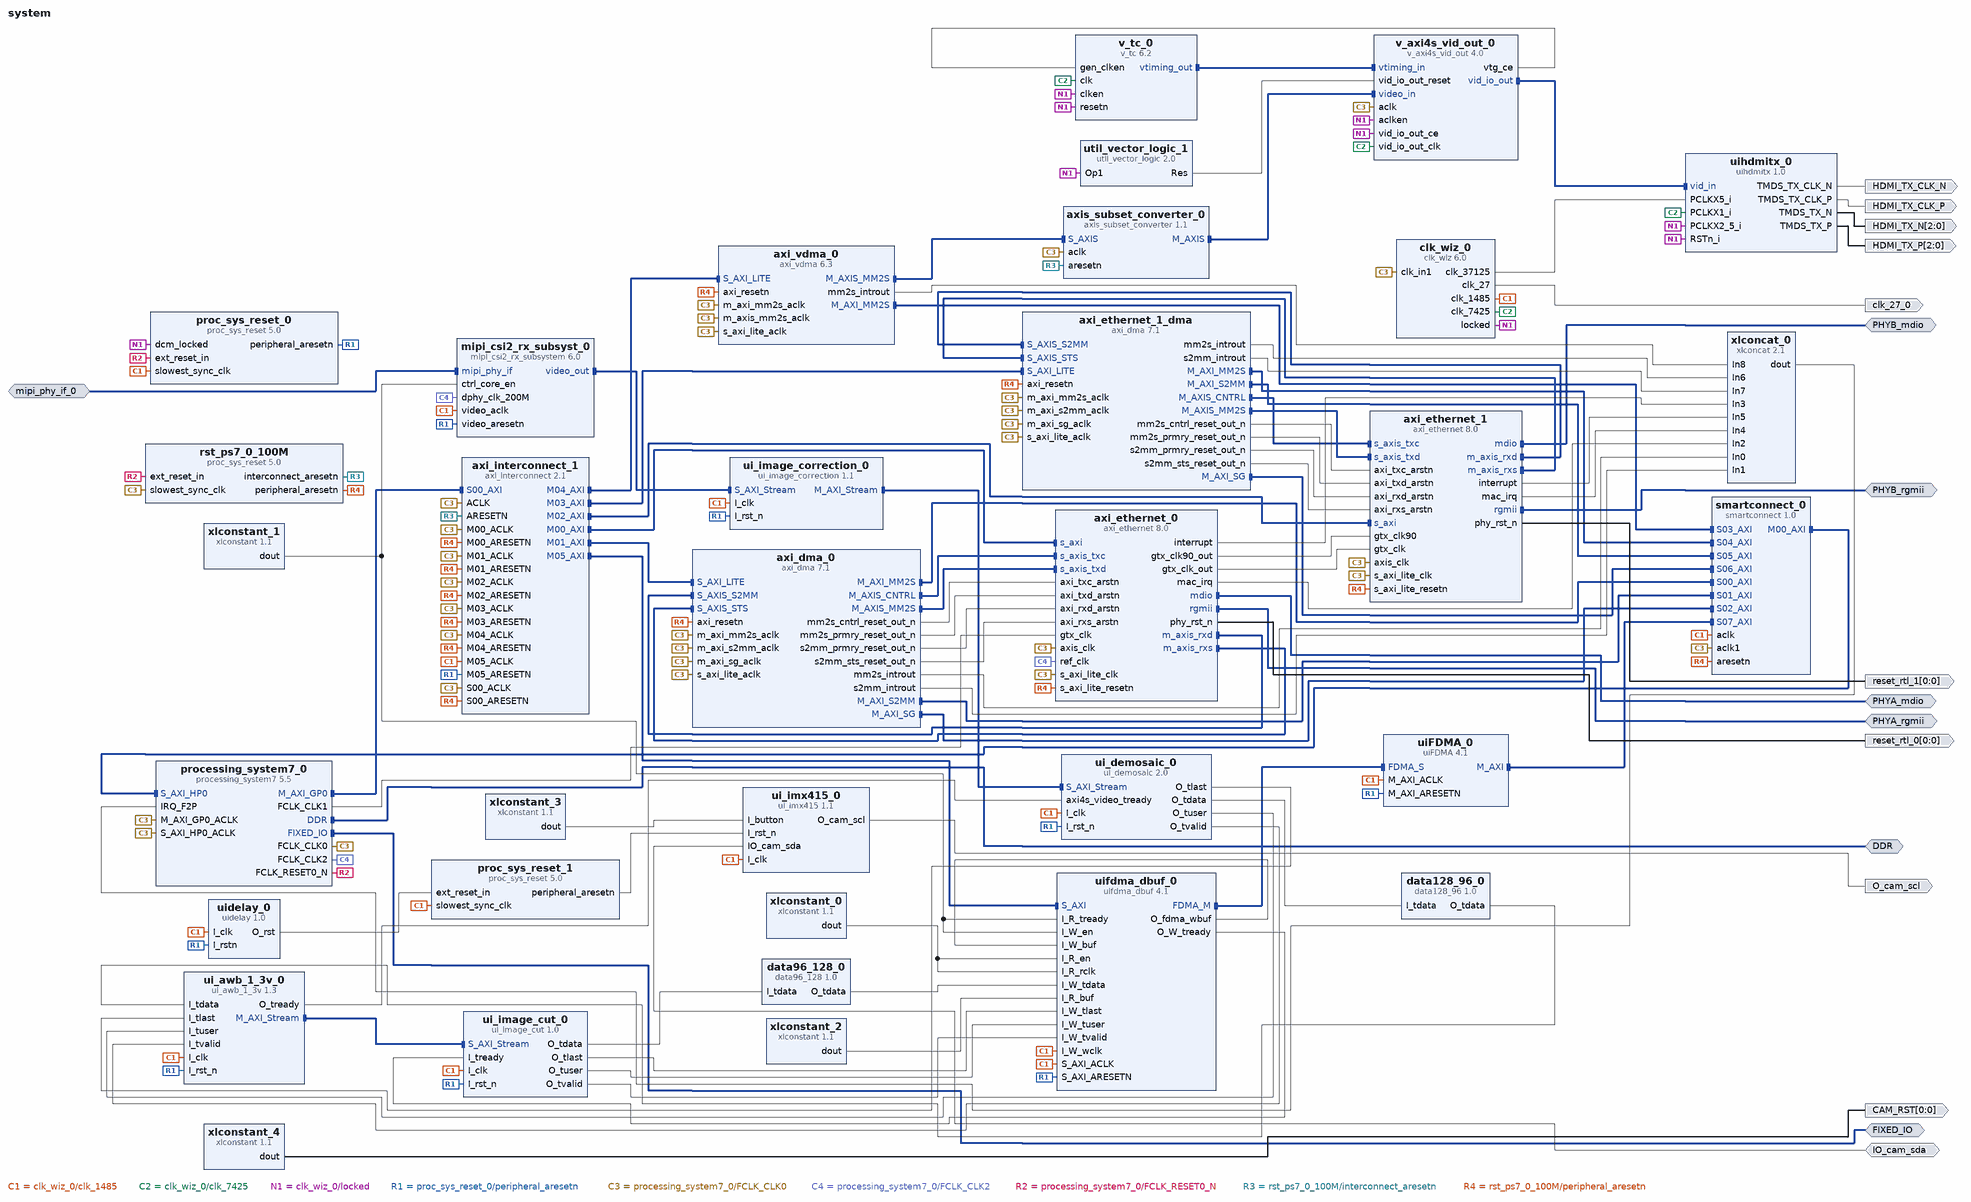
[diagram p0: block diagram of the top level]
# Vivado block design system, xc7z020clg484-2, Vivado 2025.2
create_bd_design system

create_bd_intf_port -mode Master -vlnv xilinx.com:interface:ddrx_rtl:1.0 DDR
create_bd_intf_port -mode Master -vlnv xilinx.com:display_processing_system7:fixedio_rtl:1.0 FIXED_IO
create_bd_intf_port -mode Master -vlnv xilinx.com:interface:mdio_rtl:1.0 PHYA_mdio
create_bd_intf_port -mode Master -vlnv xilinx.com:interface:rgmii_rtl:1.0 PHYA_rgmii
create_bd_intf_port -mode Master -vlnv xilinx.com:interface:mdio_rtl:1.0 PHYB_mdio
create_bd_intf_port -mode Master -vlnv xilinx.com:interface:rgmii_rtl:1.0 PHYB_rgmii
create_bd_intf_port -mode Slave -vlnv xilinx.com:interface:mipi_phy_rtl:1.0 mipi_phy_if_0
create_bd_port -dir O -type clk HDMI_TX_CLK_N
set_property -dict {CONFIG.ASSOCIATED_RESET phy_rst_n_0} [get_bd_ports HDMI_TX_CLK_N]
create_bd_port -dir O -type clk HDMI_TX_CLK_P
create_bd_port -dir O -from 2 -to 0 HDMI_TX_N
create_bd_port -dir O -from 2 -to 0 HDMI_TX_P
create_bd_port -dir O -from 0 -to 0 -type rst reset_rtl_1
set_property -dict {CONFIG.POLARITY ACTIVE_LOW} [get_bd_ports reset_rtl_1]
create_bd_port -dir O -from 0 -to 0 -type rst reset_rtl_0
set_property -dict {CONFIG.POLARITY ACTIVE_LOW} [get_bd_ports reset_rtl_0]
create_bd_port -dir O O_cam_scl
create_bd_port -dir IO IO_cam_sda
create_bd_port -dir O -type clk clk_27_0
create_bd_port -dir O -from 0 -to 0 CAM_RST

create_bd_cell -type ip -vlnv xilinx.com:ip:axi_dma:7.1 axi_dma_0
set_property -dict [list \
  CONFIG.c_include_mm2s_dre 1 \
  CONFIG.c_include_s2mm_dre 1 \
  CONFIG.c_m_axi_mm2s_data_width 64 \
  CONFIG.c_m_axi_s2mm_data_width 64 \
  CONFIG.c_mm2s_burst_size 8 \
  CONFIG.c_sg_length_width 16 \
  CONFIG.c_sg_use_stsapp_length 1 \
] [get_bd_cells axi_dma_0]
create_bd_cell -type ip -vlnv xilinx.com:ip:axi_ethernet:8.0 axi_ethernet_0
set_property -dict {CONFIG.IS_GT_WIZ_OLD 1 CONFIG.PHY_TYPE RGMII} [get_bd_cells axi_ethernet_0]
create_bd_cell -type ip -vlnv xilinx.com:ip:axi_ethernet:8.0 axi_ethernet_1
set_property -dict {CONFIG.IS_GT_WIZ_OLD 1 CONFIG.PHY_TYPE RGMII CONFIG.SupportLevel 0} [get_bd_cells axi_ethernet_1]
create_bd_cell -type ip -vlnv xilinx.com:ip:axi_dma:7.1 axi_ethernet_1_dma
set_property -dict [list \
  CONFIG.c_include_mm2s_dre 1 \
  CONFIG.c_include_s2mm_dre 1 \
  CONFIG.c_sg_length_width 16 \
  CONFIG.c_sg_use_stsapp_length 1 \
] [get_bd_cells axi_ethernet_1_dma]
create_bd_cell -type ip -vlnv xilinx.com:ip:axi_vdma:6.3 axi_vdma_0
set_property -dict [list \
  CONFIG.c_addr_width 64 \
  CONFIG.c_include_s2mm 0 \
  CONFIG.c_mm2s_genlock_mode 1 \
  CONFIG.c_mm2s_linebuffer_depth 2048 \
  CONFIG.c_mm2s_max_burst_length 64 \
  CONFIG.c_num_fstores 1 \
] [get_bd_cells axi_vdma_0]
create_bd_cell -type ip -vlnv xilinx.com:ip:axis_subset_converter:1.1 axis_subset_converter_0
set_property -dict [list \
  CONFIG.M_HAS_TKEEP 1 \
  CONFIG.M_HAS_TLAST 1 \
  CONFIG.M_HAS_TREADY 1 \
  CONFIG.M_HAS_TSTRB 0 \
  CONFIG.M_TDATA_NUM_BYTES 3 \
  CONFIG.M_TDEST_WIDTH 0 \
  CONFIG.M_TID_WIDTH 0 \
  CONFIG.M_TUSER_WIDTH 1 \
  CONFIG.S_HAS_TKEEP 1 \
  CONFIG.S_HAS_TLAST 1 \
  CONFIG.S_HAS_TREADY 1 \
  CONFIG.S_HAS_TSTRB 0 \
  CONFIG.S_TDATA_NUM_BYTES 4 \
  CONFIG.S_TDEST_WIDTH 0 \
  CONFIG.S_TID_WIDTH 0 \
  CONFIG.S_TUSER_WIDTH 1 \
  CONFIG.TDATA_REMAP {tdata[23:0]} \
  CONFIG.TKEEP_REMAP {tkeep[2:0]} \
  CONFIG.TLAST_REMAP {tlast[0]} \
  CONFIG.TUSER_REMAP {tuser[0:0]} \
] [get_bd_cells axis_subset_converter_0]
create_bd_cell -type ip -vlnv xilinx.com:ip:clk_wiz:6.0 clk_wiz_0
set_property -dict [list \
  CONFIG.CLKOUT1_JITTER 337.616 \
  CONFIG.CLKOUT1_PHASE_ERROR 322.999 \
  CONFIG.CLKOUT1_REQUESTED_OUT_FREQ 74.25 \
  CONFIG.CLKOUT2_JITTER 258.703 \
  CONFIG.CLKOUT2_PHASE_ERROR 322.999 \
  CONFIG.CLKOUT2_REQUESTED_OUT_FREQ 371.25 \
  CONFIG.CLKOUT2_USED true \
  CONFIG.CLKOUT3_JITTER 298.245 \
  CONFIG.CLKOUT3_PHASE_ERROR 322.999 \
  CONFIG.CLKOUT3_REQUESTED_OUT_FREQ 148.5 \
  CONFIG.CLKOUT3_USED true \
  CONFIG.CLKOUT4_JITTER 415.222 \
  CONFIG.CLKOUT4_PHASE_ERROR 322.999 \
  CONFIG.CLKOUT4_REQUESTED_OUT_FREQ 27.000 \
  CONFIG.CLKOUT4_USED true \
  CONFIG.CLK_OUT1_PORT clk_7425 \
  CONFIG.CLK_OUT2_PORT clk_37125 \
  CONFIG.CLK_OUT3_PORT clk_1485 \
  CONFIG.CLK_OUT4_PORT clk_27 \
  CONFIG.MMCM_CLKFBOUT_MULT_F 37.125 \
  CONFIG.MMCM_CLKOUT0_DIVIDE_F 10.000 \
  CONFIG.MMCM_CLKOUT1_DIVIDE 2 \
  CONFIG.MMCM_CLKOUT2_DIVIDE 5 \
  CONFIG.MMCM_CLKOUT3_DIVIDE 28 \
  CONFIG.MMCM_DIVCLK_DIVIDE 5 \
  CONFIG.NUM_OUT_CLKS 4 \
  CONFIG.USE_RESET false \
] [get_bd_cells clk_wiz_0]
create_bd_cell -type ip -vlnv xilinx.com:ip:processing_system7:5.5 processing_system7_0
set_property -dict [list \
  CONFIG.PCW_APU_PERIPHERAL_FREQMHZ 666.666666 \
  CONFIG.PCW_CPU_CPU_6X4X_MAX_RANGE 767 \
  CONFIG.PCW_ENET0_ENET0_IO {MIO 16 .. 27} \
  CONFIG.PCW_ENET0_GRP_MDIO_ENABLE 1 \
  CONFIG.PCW_ENET0_GRP_MDIO_IO {MIO 52 .. 53} \
  CONFIG.PCW_ENET0_PERIPHERAL_ENABLE 1 \
  CONFIG.PCW_ENET_RESET_ENABLE 0 \
  CONFIG.PCW_EN_CLK1_PORT 1 \
  CONFIG.PCW_EN_CLK2_PORT 1 \
  CONFIG.PCW_FCLK_CLK0_BUF FALSE \
  CONFIG.PCW_FPGA0_PERIPHERAL_FREQMHZ 100 \
  CONFIG.PCW_FPGA1_PERIPHERAL_FREQMHZ 125 \
  CONFIG.PCW_FPGA2_PERIPHERAL_FREQMHZ 200 \
  CONFIG.PCW_FPGA_FCLK1_ENABLE 1 \
  CONFIG.PCW_FPGA_FCLK2_ENABLE 1 \
  CONFIG.PCW_GPIO_MIO_GPIO_ENABLE 1 \
  CONFIG.PCW_GPIO_MIO_GPIO_IO MIO \
  CONFIG.PCW_I2C_RESET_ENABLE 0 \
  CONFIG.PCW_IRQ_F2P_INTR 1 \
  CONFIG.PCW_PERIPHERAL_BOARD_PRESET None \
  CONFIG.PCW_PRESET_BANK1_VOLTAGE {LVCMOS 1.8V} \
  CONFIG.PCW_QSPI_GRP_FBCLK_ENABLE 1 \
  CONFIG.PCW_QSPI_GRP_FBCLK_IO {MIO 8} \
  CONFIG.PCW_QSPI_GRP_SINGLE_SS_ENABLE 1 \
  CONFIG.PCW_QSPI_GRP_SINGLE_SS_IO {MIO 1 .. 6} \
  CONFIG.PCW_QSPI_PERIPHERAL_ENABLE 1 \
  CONFIG.PCW_QSPI_PERIPHERAL_FREQMHZ 125 \
  CONFIG.PCW_QSPI_QSPI_IO {MIO 1 .. 6} \
  CONFIG.PCW_SD0_GRP_CD_ENABLE 1 \
  CONFIG.PCW_SD0_GRP_CD_IO {MIO 47} \
  CONFIG.PCW_SD0_GRP_WP_ENABLE 0 \
  CONFIG.PCW_SD0_PERIPHERAL_ENABLE 1 \
  CONFIG.PCW_SD0_SD0_IO {MIO 40 .. 45} \
  CONFIG.PCW_SD1_GRP_CD_ENABLE 1 \
  CONFIG.PCW_SD1_GRP_CD_IO {MIO 9} \
  CONFIG.PCW_SD1_PERIPHERAL_ENABLE 1 \
  CONFIG.PCW_SD1_SD1_IO {MIO 10 .. 15} \
  CONFIG.PCW_SDIO_PERIPHERAL_FREQMHZ 50 \
  CONFIG.PCW_SINGLE_QSPI_DATA_MODE x4 \
  CONFIG.PCW_UART1_PERIPHERAL_ENABLE 1 \
  CONFIG.PCW_UART1_UART1_IO {MIO 48 .. 49} \
  CONFIG.PCW_UART_PERIPHERAL_FREQMHZ 100 \
  CONFIG.PCW_UIPARAM_DDR_FREQ_MHZ 533.333333 \
  CONFIG.PCW_UIPARAM_DDR_MEMORY_TYPE {DDR 3 (Low Voltage)} \
  CONFIG.PCW_UIPARAM_DDR_PARTNO {MT41K256M16 RE-125} \
  CONFIG.PCW_USB0_PERIPHERAL_ENABLE 1 \
  CONFIG.PCW_USB0_RESET_ENABLE 0 \
  CONFIG.PCW_USB0_USB0_IO {MIO 28 .. 39} \
  CONFIG.PCW_USB_RESET_ENABLE 1 \
  CONFIG.PCW_USB_RESET_SELECT {Share reset pin} \
  CONFIG.PCW_USE_FABRIC_INTERRUPT 1 \
  CONFIG.PCW_USE_S_AXI_HP0 1 \
] [get_bd_cells processing_system7_0]
# 509 more settings of processing_system7_0 are not shown: defaults, MIO pin electricals, DDR timing, and values the tool derives
create_bd_cell -type ip -vlnv xilinx.com:ip:proc_sys_reset:5.0 rst_ps7_0_100M
create_bd_cell -type ip -vlnv xilinx.com:user:uihdmitx:1.0 uihdmitx_0
set_property -dict {CONFIG.FAMILY 7FAMILY} [get_bd_cells uihdmitx_0]
create_bd_cell -type ip -vlnv xilinx.com:ip:util_vector_logic:2.0 util_vector_logic_1
set_property -dict {CONFIG.C_OPERATION not CONFIG.C_SIZE 1} [get_bd_cells util_vector_logic_1]
create_bd_cell -type ip -vlnv xilinx.com:ip:v_axi4s_vid_out:4.0 v_axi4s_vid_out_0
set_property -dict {CONFIG.C_HAS_ASYNC_CLK 1} [get_bd_cells v_axi4s_vid_out_0]
create_bd_cell -type ip -vlnv xilinx.com:ip:v_tc:6.2 v_tc_0
set_property -dict {CONFIG.HAS_AXI4_LITE false CONFIG.enable_detection false} [get_bd_cells v_tc_0]
create_bd_cell -type ip -vlnv xilinx.com:ip:xlconcat:2.1 xlconcat_0
set_property -dict {CONFIG.NUM_PORTS 9 CONFIG.dout_width 9} [get_bd_cells xlconcat_0]
create_bd_cell -type ip -vlnv xilinx.com:ip:mipi_csi2_rx_subsystem:6.0 mipi_csi2_rx_subsyst_0
set_property -dict [list \
  CONFIG.CMN_NUM_LANES 4 \
  CONFIG.CMN_NUM_PIXELS 4 \
  CONFIG.CMN_PXL_FORMAT RAW10 \
  CONFIG.CSI_CONTROLLER_REG_IF false \
  CONFIG.C_CSI_EN_CRC false \
  CONFIG.C_EN_7S_LINERATE_CHECK true \
  CONFIG.DPY_LINE_RATE 1000 \
] [get_bd_cells mipi_csi2_rx_subsyst_0]
create_bd_cell -type ip -vlnv xilinx.com:ip:proc_sys_reset:5.0 proc_sys_reset_0
create_bd_cell -type ip -vlnv xilinx.com:ip:xlconstant:1.1 xlconstant_1
create_bd_cell -type ip -vlnv xilinx.com:user:ui_image_correction:1.1 ui_image_correction_0
create_bd_cell -type ip -vlnv xilinx.com:user:ui_demosaic:2.0 ui_demosaic_0
create_bd_cell -type ip -vlnv xilinx.com:user:data128_96:1.0 data128_96_0
create_bd_cell -type ip -vlnv xilinx.com:user:data96_128:1.0 data96_128_0
create_bd_cell -type ip -vlnv xilinx.com:user:ui_awb_1_3v:1.3 ui_awb_1_3v_0
create_bd_cell -type ip -vlnv xilinx.com:user:ui_image_cut:1.0 ui_image_cut_0
set_property -dict [list \
  CONFIG.DATA_WIDTH 96 \
  CONFIG.IMG_HEIGHT 1080 \
  CONFIG.IMG_WIDTH 1920 \
  CONFIG.Pixel_Per_Clock 4 \
  CONFIG.SKIP_COLS_right 0 \
  CONFIG.SKIP_ROWS_bottom 0 \
] [get_bd_cells ui_image_cut_0]
create_bd_cell -type ip -vlnv xilinx.com:user:uifdma_dbuf:4.1 uifdma_dbuf_0
set_property -dict [list \
  CONFIG.R_BASEADDR 0x20000000 \
  CONFIG.R_BUFDEPTH 64 \
  CONFIG.R_DSIZEBITS 23 \
  CONFIG.W_BASEADDR 0x20000000 \
  CONFIG.W_DATAWIDTH 128 \
  CONFIG.W_DSIZEBITS 23 \
] [get_bd_cells uifdma_dbuf_0]
create_bd_cell -type ip -vlnv xilinx.com:ip:xlconstant:1.1 xlconstant_0
create_bd_cell -type ip -vlnv xilinx.com:user:uiFDMA:4.1 uiFDMA_0
create_bd_cell -type ip -vlnv xilinx.com:ip:axi_interconnect:2.1 axi_interconnect_1
set_property -dict {CONFIG.NUM_MI 6} [get_bd_cells axi_interconnect_1]
create_bd_cell -type ip -vlnv xilinx.com:ip:smartconnect:1.0 smartconnect_0
set_property -dict {CONFIG.NUM_CLKS 2 CONFIG.NUM_SI 8} [get_bd_cells smartconnect_0]
create_bd_cell -type ip -vlnv xilinx.com:user:ui_imx415:1.1 ui_imx415_0
set_property -dict {CONFIG.Resolution imx415_1920x1080} [get_bd_cells ui_imx415_0]
create_bd_cell -type ip -vlnv xilinx.com:user:uidelay:1.0 uidelay_0
create_bd_cell -type ip -vlnv xilinx.com:ip:xlconstant:1.1 xlconstant_2
set_property -dict {CONFIG.CONST_VAL 0 CONFIG.CONST_WIDTH 8} [get_bd_cells xlconstant_2]
create_bd_cell -type ip -vlnv xilinx.com:ip:proc_sys_reset:5.0 proc_sys_reset_1
create_bd_cell -type ip -vlnv xilinx.com:ip:xlconstant:1.1 xlconstant_3
set_property -dict {CONFIG.CONST_VAL 0 CONFIG.CONST_WIDTH 2} [get_bd_cells xlconstant_3]
create_bd_cell -type ip -vlnv xilinx.com:ip:xlconstant:1.1 xlconstant_4

# ---- connections ----

connect_bd_intf_net [get_bd_intf_pins axi_dma_0/M_AXIS_CNTRL] [get_bd_intf_pins axi_ethernet_0/s_axis_txc]
connect_bd_intf_net [get_bd_intf_pins axi_dma_0/M_AXIS_MM2S] [get_bd_intf_pins axi_ethernet_0/s_axis_txd]
connect_bd_intf_net [get_bd_intf_pins axi_dma_0/M_AXI_MM2S] [get_bd_intf_pins smartconnect_0/S00_AXI]
connect_bd_intf_net [get_bd_intf_pins axi_dma_0/M_AXI_S2MM] [get_bd_intf_pins smartconnect_0/S01_AXI]
connect_bd_intf_net [get_bd_intf_pins axi_dma_0/M_AXI_SG] [get_bd_intf_pins smartconnect_0/S02_AXI]
connect_bd_intf_net [get_bd_intf_pins axi_dma_0/S_AXIS_S2MM] [get_bd_intf_pins axi_ethernet_0/m_axis_rxd]
connect_bd_intf_net [get_bd_intf_pins axi_dma_0/S_AXIS_STS] [get_bd_intf_pins axi_ethernet_0/m_axis_rxs]
connect_bd_intf_net [get_bd_intf_ports PHYA_mdio] [get_bd_intf_pins axi_ethernet_0/mdio]
connect_bd_intf_net [get_bd_intf_ports PHYA_rgmii] [get_bd_intf_pins axi_ethernet_0/rgmii]
connect_bd_intf_net [get_bd_intf_pins axi_ethernet_1_dma/M_AXIS_CNTRL] [get_bd_intf_pins axi_ethernet_1/s_axis_txc]
connect_bd_intf_net [get_bd_intf_pins axi_ethernet_1_dma/M_AXIS_MM2S] [get_bd_intf_pins axi_ethernet_1/s_axis_txd]
connect_bd_intf_net [get_bd_intf_pins axi_ethernet_1_dma/M_AXI_MM2S] [get_bd_intf_pins smartconnect_0/S04_AXI]
connect_bd_intf_net [get_bd_intf_pins axi_ethernet_1_dma/M_AXI_S2MM] [get_bd_intf_pins smartconnect_0/S05_AXI]
connect_bd_intf_net [get_bd_intf_pins axi_ethernet_1_dma/M_AXI_SG] [get_bd_intf_pins smartconnect_0/S06_AXI]
connect_bd_intf_net [get_bd_intf_pins axi_ethernet_1_dma/S_AXIS_S2MM] [get_bd_intf_pins axi_ethernet_1/m_axis_rxd]
connect_bd_intf_net [get_bd_intf_pins axi_ethernet_1_dma/S_AXIS_STS] [get_bd_intf_pins axi_ethernet_1/m_axis_rxs]
connect_bd_intf_net [get_bd_intf_ports PHYB_mdio] [get_bd_intf_pins axi_ethernet_1/mdio]
connect_bd_intf_net [get_bd_intf_ports PHYB_rgmii] [get_bd_intf_pins axi_ethernet_1/rgmii]
connect_bd_intf_net [get_bd_intf_pins axi_ethernet_0/s_axi] [get_bd_intf_pins axi_interconnect_1/M00_AXI]
connect_bd_intf_net [get_bd_intf_pins axi_dma_0/S_AXI_LITE] [get_bd_intf_pins axi_interconnect_1/M01_AXI]
connect_bd_intf_net [get_bd_intf_pins axi_ethernet_1/s_axi] [get_bd_intf_pins axi_interconnect_1/M02_AXI]
connect_bd_intf_net [get_bd_intf_pins axi_ethernet_1_dma/S_AXI_LITE] [get_bd_intf_pins axi_interconnect_1/M03_AXI]
connect_bd_intf_net [get_bd_intf_pins axi_vdma_0/S_AXI_LITE] [get_bd_intf_pins axi_interconnect_1/M04_AXI]
connect_bd_intf_net [get_bd_intf_pins uifdma_dbuf_0/S_AXI] [get_bd_intf_pins axi_interconnect_1/M05_AXI]
connect_bd_intf_net [get_bd_intf_pins axi_vdma_0/M_AXIS_MM2S] [get_bd_intf_pins axis_subset_converter_0/S_AXIS]
connect_bd_intf_net [get_bd_intf_pins axi_vdma_0/M_AXI_MM2S] [get_bd_intf_pins smartconnect_0/S03_AXI]
connect_bd_intf_net [get_bd_intf_pins axis_subset_converter_0/M_AXIS] [get_bd_intf_pins v_axi4s_vid_out_0/video_in]
connect_bd_intf_net [get_bd_intf_pins ui_image_correction_0/S_AXI_Stream] [get_bd_intf_pins mipi_csi2_rx_subsyst_0/video_out]
connect_bd_intf_net -intf_net mipi_phy_if_0_1 [get_bd_intf_ports mipi_phy_if_0] [get_bd_intf_pins mipi_csi2_rx_subsyst_0/mipi_phy_if]
connect_bd_intf_net [get_bd_intf_ports DDR] [get_bd_intf_pins processing_system7_0/DDR]
connect_bd_intf_net [get_bd_intf_ports FIXED_IO] [get_bd_intf_pins processing_system7_0/FIXED_IO]
connect_bd_intf_net [get_bd_intf_pins processing_system7_0/M_AXI_GP0] [get_bd_intf_pins axi_interconnect_1/S00_AXI]
connect_bd_intf_net [get_bd_intf_pins smartconnect_0/M00_AXI] [get_bd_intf_pins processing_system7_0/S_AXI_HP0]
connect_bd_intf_net [get_bd_intf_pins uiFDMA_0/M_AXI] [get_bd_intf_pins smartconnect_0/S07_AXI]
connect_bd_intf_net [get_bd_intf_pins ui_awb_1_3v_0/M_AXI_Stream] [get_bd_intf_pins ui_image_cut_0/S_AXI_Stream]
connect_bd_intf_net [get_bd_intf_pins ui_image_correction_0/M_AXI_Stream] [get_bd_intf_pins ui_demosaic_0/S_AXI_Stream]
connect_bd_intf_net [get_bd_intf_pins uifdma_dbuf_0/FDMA_M] [get_bd_intf_pins uiFDMA_0/FDMA_S]
connect_bd_intf_net [get_bd_intf_pins uihdmitx_0/vid_in] [get_bd_intf_pins v_axi4s_vid_out_0/vid_io_out]
connect_bd_intf_net [get_bd_intf_pins v_axi4s_vid_out_0/vtiming_in] [get_bd_intf_pins v_tc_0/vtiming_out]
connect_bd_net [get_bd_ports IO_cam_sda] [get_bd_pins ui_imx415_0/IO_cam_sda]
connect_bd_net [get_bd_pins axi_dma_0/mm2s_cntrl_reset_out_n] [get_bd_pins axi_ethernet_0/axi_txc_arstn]
connect_bd_net [get_bd_pins axi_dma_0/mm2s_introut] [get_bd_pins xlconcat_0/In0]
connect_bd_net [get_bd_pins axi_dma_0/mm2s_prmry_reset_out_n] [get_bd_pins axi_ethernet_0/axi_txd_arstn]
connect_bd_net [get_bd_pins axi_dma_0/s2mm_introut] [get_bd_pins xlconcat_0/In1]
connect_bd_net [get_bd_pins axi_dma_0/s2mm_prmry_reset_out_n] [get_bd_pins axi_ethernet_0/axi_rxd_arstn]
connect_bd_net [get_bd_pins axi_dma_0/s2mm_sts_reset_out_n] [get_bd_pins axi_ethernet_0/axi_rxs_arstn]
connect_bd_net [get_bd_pins axi_ethernet_0/gtx_clk90_out] [get_bd_pins axi_ethernet_1/gtx_clk90]
connect_bd_net [get_bd_pins axi_ethernet_0/gtx_clk_out] [get_bd_pins axi_ethernet_1/gtx_clk]
connect_bd_net [get_bd_pins axi_ethernet_0/interrupt] [get_bd_pins xlconcat_0/In3]
connect_bd_net [get_bd_pins axi_ethernet_0/mac_irq] [get_bd_pins xlconcat_0/In2]
connect_bd_net [get_bd_pins axi_ethernet_0/phy_rst_n] [get_bd_ports reset_rtl_0]
connect_bd_net [get_bd_pins axi_ethernet_1_dma/mm2s_cntrl_reset_out_n] [get_bd_pins axi_ethernet_1/axi_txc_arstn]
connect_bd_net [get_bd_pins axi_ethernet_1_dma/mm2s_introut] [get_bd_pins xlconcat_0/In6]
connect_bd_net [get_bd_pins axi_ethernet_1_dma/mm2s_prmry_reset_out_n] [get_bd_pins axi_ethernet_1/axi_txd_arstn]
connect_bd_net [get_bd_pins axi_ethernet_1_dma/s2mm_introut] [get_bd_pins xlconcat_0/In7]
connect_bd_net [get_bd_pins axi_ethernet_1_dma/s2mm_prmry_reset_out_n] [get_bd_pins axi_ethernet_1/axi_rxd_arstn]
connect_bd_net [get_bd_pins axi_ethernet_1_dma/s2mm_sts_reset_out_n] [get_bd_pins axi_ethernet_1/axi_rxs_arstn]
connect_bd_net [get_bd_pins axi_ethernet_1/interrupt] [get_bd_pins xlconcat_0/In5]
connect_bd_net [get_bd_pins axi_ethernet_1/mac_irq] [get_bd_pins xlconcat_0/In4]
connect_bd_net [get_bd_pins axi_ethernet_1/phy_rst_n] [get_bd_ports reset_rtl_1]
connect_bd_net [get_bd_pins axi_vdma_0/mm2s_introut] [get_bd_pins xlconcat_0/In8]
connect_bd_net [get_bd_pins clk_wiz_0/clk_27] [get_bd_ports clk_27_0]
connect_bd_net [get_bd_pins clk_wiz_0/clk_1485] \
  [get_bd_pins mipi_csi2_rx_subsyst_0/video_aclk] [get_bd_pins ui_image_correction_0/I_clk] [get_bd_pins ui_demosaic_0/I_clk] \
  [get_bd_pins ui_awb_1_3v_0/I_clk] [get_bd_pins ui_image_cut_0/I_clk] [get_bd_pins uifdma_dbuf_0/S_AXI_ACLK] \
  [get_bd_pins uifdma_dbuf_0/I_W_wclk] [get_bd_pins uiFDMA_0/M_AXI_ACLK] [get_bd_pins proc_sys_reset_0/slowest_sync_clk] \
  [get_bd_pins axi_interconnect_1/M05_ACLK] [get_bd_pins smartconnect_0/aclk] [get_bd_pins ui_imx415_0/I_clk] \
  [get_bd_pins uidelay_0/I_clk] [get_bd_pins proc_sys_reset_1/slowest_sync_clk]
connect_bd_net [get_bd_pins clk_wiz_0/clk_37125] [get_bd_pins uihdmitx_0/PCLKX5_i]
connect_bd_net -net clk_wiz_0_clk_out1 [get_bd_pins clk_wiz_0/clk_7425] \
  [get_bd_pins uihdmitx_0/PCLKX1_i] [get_bd_pins v_axi4s_vid_out_0/vid_io_out_clk] [get_bd_pins v_tc_0/clk]
connect_bd_net [get_bd_pins clk_wiz_0/locked] \
  [get_bd_pins uihdmitx_0/RSTn_i] [get_bd_pins uihdmitx_0/PCLKX2_5_i] [get_bd_pins util_vector_logic_1/Op1] \
  [get_bd_pins v_axi4s_vid_out_0/aclken] [get_bd_pins v_axi4s_vid_out_0/vid_io_out_ce] [get_bd_pins v_tc_0/clken] \
  [get_bd_pins v_tc_0/resetn] [get_bd_pins proc_sys_reset_0/dcm_locked]
connect_bd_net [get_bd_pins data128_96_0/O_tdata] [get_bd_pins ui_awb_1_3v_0/I_tdata]
connect_bd_net [get_bd_pins data96_128_0/O_tdata] [get_bd_pins uifdma_dbuf_0/I_W_tdata]
connect_bd_net [get_bd_pins proc_sys_reset_0/peripheral_aresetn] \
  [get_bd_pins mipi_csi2_rx_subsyst_0/video_aresetn] [get_bd_pins ui_image_correction_0/I_rst_n] \
  [get_bd_pins ui_demosaic_0/I_rst_n] [get_bd_pins ui_awb_1_3v_0/I_rst_n] [get_bd_pins ui_image_cut_0/I_rst_n] \
  [get_bd_pins uifdma_dbuf_0/S_AXI_ARESETN] [get_bd_pins uiFDMA_0/M_AXI_ARESETN] [get_bd_pins axi_interconnect_1/M05_ARESETN] \
  [get_bd_pins uidelay_0/I_rstn]
connect_bd_net [get_bd_pins proc_sys_reset_1/peripheral_aresetn] [get_bd_pins ui_imx415_0/I_rst_n]
connect_bd_net [get_bd_pins processing_system7_0/FCLK_CLK0] \
  [get_bd_pins axi_dma_0/s_axi_lite_aclk] [get_bd_pins axi_dma_0/m_axi_sg_aclk] [get_bd_pins axi_dma_0/m_axi_mm2s_aclk] \
  [get_bd_pins axi_dma_0/m_axi_s2mm_aclk] [get_bd_pins axi_ethernet_0/s_axi_lite_clk] [get_bd_pins axi_ethernet_0/axis_clk] \
  [get_bd_pins axi_ethernet_1/s_axi_lite_clk] [get_bd_pins axi_ethernet_1/axis_clk] \
  [get_bd_pins axi_ethernet_1_dma/s_axi_lite_aclk] [get_bd_pins axi_ethernet_1_dma/m_axi_sg_aclk] \
  [get_bd_pins axi_ethernet_1_dma/m_axi_mm2s_aclk] [get_bd_pins axi_ethernet_1_dma/m_axi_s2mm_aclk] \
  [get_bd_pins axi_vdma_0/s_axi_lite_aclk] [get_bd_pins axi_vdma_0/m_axi_mm2s_aclk] [get_bd_pins axi_vdma_0/m_axis_mm2s_aclk] \
  [get_bd_pins axis_subset_converter_0/aclk] [get_bd_pins clk_wiz_0/clk_in1] \
  [get_bd_pins processing_system7_0/M_AXI_GP0_ACLK] [get_bd_pins processing_system7_0/S_AXI_HP0_ACLK] \
  [get_bd_pins rst_ps7_0_100M/slowest_sync_clk] [get_bd_pins v_axi4s_vid_out_0/aclk] [get_bd_pins axi_interconnect_1/ACLK] \
  [get_bd_pins axi_interconnect_1/S00_ACLK] [get_bd_pins axi_interconnect_1/M00_ACLK] \
  [get_bd_pins axi_interconnect_1/M01_ACLK] [get_bd_pins axi_interconnect_1/M02_ACLK] \
  [get_bd_pins axi_interconnect_1/M03_ACLK] [get_bd_pins axi_interconnect_1/M04_ACLK] [get_bd_pins smartconnect_0/aclk1]
connect_bd_net [get_bd_pins processing_system7_0/FCLK_CLK1] [get_bd_pins axi_ethernet_0/gtx_clk]
connect_bd_net [get_bd_pins processing_system7_0/FCLK_CLK2] [get_bd_pins axi_ethernet_0/ref_clk] [get_bd_pins mipi_csi2_rx_subsyst_0/dphy_clk_200M]
connect_bd_net [get_bd_pins processing_system7_0/FCLK_RESET0_N] [get_bd_pins rst_ps7_0_100M/ext_reset_in] [get_bd_pins proc_sys_reset_0/ext_reset_in]
connect_bd_net [get_bd_pins rst_ps7_0_100M/interconnect_aresetn] \
  [get_bd_pins axis_subset_converter_0/aresetn] [get_bd_pins axi_interconnect_1/ARESETN]
connect_bd_net [get_bd_pins rst_ps7_0_100M/peripheral_aresetn] \
  [get_bd_pins axi_dma_0/axi_resetn] [get_bd_pins axi_ethernet_0/s_axi_lite_resetn] \
  [get_bd_pins axi_ethernet_1/s_axi_lite_resetn] [get_bd_pins axi_ethernet_1_dma/axi_resetn] \
  [get_bd_pins axi_vdma_0/axi_resetn] [get_bd_pins axi_interconnect_1/M00_ARESETN] \
  [get_bd_pins axi_interconnect_1/S00_ARESETN] [get_bd_pins axi_interconnect_1/M04_ARESETN] \
  [get_bd_pins axi_interconnect_1/M03_ARESETN] [get_bd_pins axi_interconnect_1/M02_ARESETN] \
  [get_bd_pins axi_interconnect_1/M01_ARESETN] [get_bd_pins smartconnect_0/aresetn]
connect_bd_net [get_bd_pins ui_awb_1_3v_0/O_tready] [get_bd_pins ui_demosaic_0/axi4s_video_tready]
connect_bd_net [get_bd_pins ui_demosaic_0/O_tdata] [get_bd_pins data128_96_0/I_tdata]
connect_bd_net [get_bd_pins ui_demosaic_0/O_tlast] [get_bd_pins ui_awb_1_3v_0/I_tlast]
connect_bd_net [get_bd_pins ui_demosaic_0/O_tuser] [get_bd_pins ui_awb_1_3v_0/I_tuser]
connect_bd_net [get_bd_pins ui_demosaic_0/O_tvalid] [get_bd_pins ui_awb_1_3v_0/I_tvalid]
connect_bd_net [get_bd_pins ui_image_cut_0/O_tdata] [get_bd_pins data96_128_0/I_tdata]
connect_bd_net [get_bd_pins ui_image_cut_0/O_tlast] [get_bd_pins uifdma_dbuf_0/I_W_tlast]
connect_bd_net [get_bd_pins ui_image_cut_0/O_tuser] [get_bd_pins uifdma_dbuf_0/I_W_tuser]
connect_bd_net [get_bd_pins ui_image_cut_0/O_tvalid] [get_bd_pins uifdma_dbuf_0/I_W_tvalid]
connect_bd_net [get_bd_pins ui_imx415_0/O_cam_scl] [get_bd_ports O_cam_scl]
connect_bd_net [get_bd_pins uidelay_0/O_rst] [get_bd_pins proc_sys_reset_1/ext_reset_in]
connect_bd_net [get_bd_pins uifdma_dbuf_0/O_W_tready] [get_bd_pins ui_image_cut_0/I_tready]
connect_bd_net [get_bd_pins uifdma_dbuf_0/O_fdma_wbuf] [get_bd_pins uifdma_dbuf_0/I_W_buf]
connect_bd_net [get_bd_pins uihdmitx_0/TMDS_TX_CLK_N] [get_bd_ports HDMI_TX_CLK_N]
connect_bd_net [get_bd_pins uihdmitx_0/TMDS_TX_CLK_P] [get_bd_ports HDMI_TX_CLK_P]
connect_bd_net [get_bd_pins uihdmitx_0/TMDS_TX_N] [get_bd_ports HDMI_TX_N]
connect_bd_net [get_bd_pins uihdmitx_0/TMDS_TX_P] [get_bd_ports HDMI_TX_P]
connect_bd_net [get_bd_pins util_vector_logic_1/Res] [get_bd_pins v_axi4s_vid_out_0/vid_io_out_reset]
connect_bd_net [get_bd_pins v_axi4s_vid_out_0/vtg_ce] [get_bd_pins v_tc_0/gen_clken]
connect_bd_net [get_bd_pins xlconcat_0/dout] [get_bd_pins processing_system7_0/IRQ_F2P]
connect_bd_net [get_bd_pins xlconstant_0/dout] [get_bd_pins uifdma_dbuf_0/I_R_en] [get_bd_pins uifdma_dbuf_0/I_R_rclk]
connect_bd_net [get_bd_pins xlconstant_1/dout] \
  [get_bd_pins mipi_csi2_rx_subsyst_0/ctrl_core_en] [get_bd_pins uifdma_dbuf_0/I_R_tready] [get_bd_pins uifdma_dbuf_0/I_W_en]
connect_bd_net [get_bd_pins xlconstant_2/dout] [get_bd_pins uifdma_dbuf_0/I_R_buf]
connect_bd_net [get_bd_pins xlconstant_3/dout] [get_bd_pins ui_imx415_0/I_button]
connect_bd_net [get_bd_pins xlconstant_4/dout] [get_bd_ports CAM_RST]

# ---- address map ----
assign_bd_address -offset 0x00000000 -range 1G -target_address_space [get_bd_addr_spaces axi_dma_0/Data_MM2S] [get_bd_addr_segs processing_system7_0/S_AXI_HP0/HP0_DDR_LOWOCM]
assign_bd_address -offset 0x00000000 -range 1G -target_address_space [get_bd_addr_spaces axi_dma_0/Data_S2MM] [get_bd_addr_segs processing_system7_0/S_AXI_HP0/HP0_DDR_LOWOCM]
assign_bd_address -offset 0x00000000 -range 1G -target_address_space [get_bd_addr_spaces axi_dma_0/Data_SG] [get_bd_addr_segs processing_system7_0/S_AXI_HP0/HP0_DDR_LOWOCM]
assign_bd_address -offset 0x00000000 -range 1G -target_address_space [get_bd_addr_spaces axi_ethernet_1_dma/Data_MM2S] [get_bd_addr_segs processing_system7_0/S_AXI_HP0/HP0_DDR_LOWOCM]
assign_bd_address -offset 0x00000000 -range 1G -target_address_space [get_bd_addr_spaces axi_ethernet_1_dma/Data_S2MM] [get_bd_addr_segs processing_system7_0/S_AXI_HP0/HP0_DDR_LOWOCM]
assign_bd_address -offset 0x00000000 -range 1G -target_address_space [get_bd_addr_spaces axi_ethernet_1_dma/Data_SG] [get_bd_addr_segs processing_system7_0/S_AXI_HP0/HP0_DDR_LOWOCM]
assign_bd_address -offset 0x0000000000000000 -range 1G -target_address_space [get_bd_addr_spaces axi_vdma_0/Data_MM2S] [get_bd_addr_segs processing_system7_0/S_AXI_HP0/HP0_DDR_LOWOCM]
assign_bd_address -offset 0x40400000 -range 64K -target_address_space [get_bd_addr_spaces processing_system7_0/Data] [get_bd_addr_segs axi_dma_0/S_AXI_LITE/Reg]
assign_bd_address -offset 0x40410000 -range 64K -target_address_space [get_bd_addr_spaces processing_system7_0/Data] [get_bd_addr_segs axi_ethernet_1_dma/S_AXI_LITE/Reg]
assign_bd_address -offset 0x41000000 -range 256K -target_address_space [get_bd_addr_spaces processing_system7_0/Data] [get_bd_addr_segs axi_ethernet_0/s_axi/Reg0]
assign_bd_address -offset 0x41040000 -range 256K -target_address_space [get_bd_addr_spaces processing_system7_0/Data] [get_bd_addr_segs axi_ethernet_1/s_axi/Reg0]
assign_bd_address -offset 0x43000000 -range 64K -target_address_space [get_bd_addr_spaces processing_system7_0/Data] [get_bd_addr_segs axi_vdma_0/S_AXI_LITE/Reg]
assign_bd_address -offset 0x43C00000 -range 64K -target_address_space [get_bd_addr_spaces processing_system7_0/Data] [get_bd_addr_segs uifdma_dbuf_0/S_AXI/reg0]
assign_bd_address -offset 0x00000000 -range 1G -target_address_space [get_bd_addr_spaces uiFDMA_0/M_AXI] [get_bd_addr_segs processing_system7_0/S_AXI_HP0/HP0_DDR_LOWOCM]

validate_bd_design
save_bd_design
